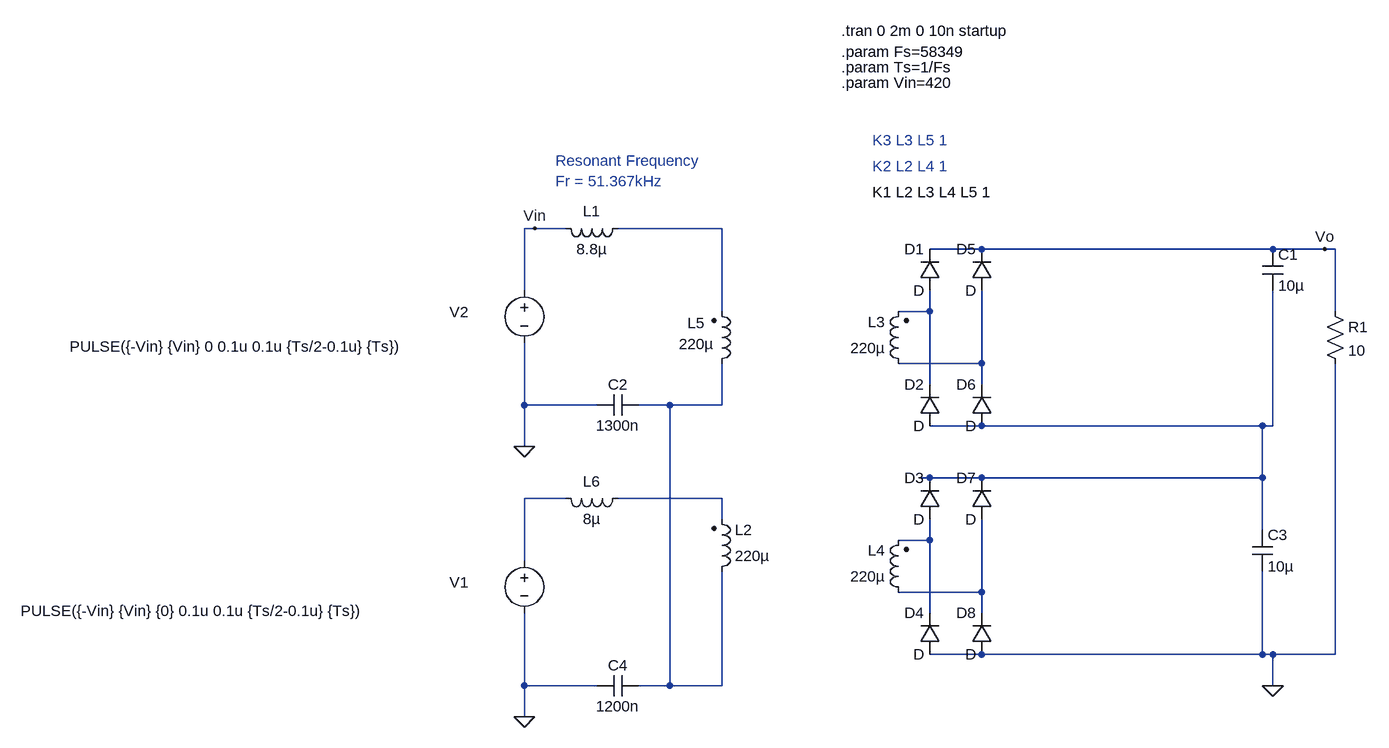
[diagram p0: schematic [Li2020] LLC 2-phase IPOS coupled transformer.asc]
[Li2020] LLC 2-phase IPOS coupled transformer.asc, the LTspice schematic file:
Version 4
SHEET 1 880 1140
WIRE -528 -96 -544 -96
WIRE -480 -96 -528 -96
WIRE -240 -96 -400 -96
WIRE 160 -64 80 -64
WIRE 608 -64 160 -64
WIRE 688 -64 608 -64
WIRE 704 -64 688 -64
WIRE -544 0 -544 -96
WIRE -240 32 -240 -96
WIRE 80 32 80 0
WIRE 80 32 32 32
WIRE 704 32 704 -64
WIRE 160 112 160 0
WIRE 160 112 32 112
WIRE 80 144 80 32
WIRE 160 144 160 112
WIRE -544 176 -544 80
WIRE -432 176 -544 176
WIRE -320 176 -368 176
WIRE -240 176 -240 112
WIRE -240 176 -320 176
WIRE 160 208 80 208
WIRE 592 208 160 208
WIRE 608 208 608 0
WIRE 608 208 592 208
WIRE -544 240 -544 176
WIRE 80 288 64 288
WIRE 160 288 80 288
WIRE 592 288 592 208
WIRE 592 288 160 288
WIRE -480 320 -544 320
WIRE -240 320 -400 320
WIRE -240 352 -240 320
WIRE 592 368 592 288
WIRE 80 384 80 352
WIRE 80 384 32 384
WIRE -544 416 -544 320
WIRE 160 464 160 352
WIRE 160 464 32 464
WIRE 80 496 80 384
WIRE 160 496 160 464
WIRE 160 560 80 560
WIRE 592 560 592 432
WIRE 592 560 160 560
WIRE 608 560 592 560
WIRE 704 560 704 112
WIRE 704 560 608 560
WIRE -544 608 -544 496
WIRE -432 608 -544 608
WIRE -320 608 -320 176
WIRE -320 608 -368 608
WIRE -240 608 -240 432
WIRE -240 608 -320 608
WIRE 608 608 608 560
WIRE -544 656 -544 608
FLAG 608 608 0
FLAG 688 -64 Vo
FLAG -544 240 0
FLAG -528 -96 Vin
FLAG -544 656 0
SYMBOL ind -496 -112 M90
WINDOW 0 5 56 VBottom 2
WINDOW 3 32 56 VTop 2
SYMATTR InstName L1
SYMATTR Value 8.8µ
SYMBOL ind2 -256 448 M180
WINDOW 0 36 80 Left 2
WINDOW 3 36 40 Left 2
SYMATTR InstName L2
SYMATTR Value 220µ
SYMATTR Type ind
SYMBOL ind2 48 128 R180
WINDOW 0 36 80 Left 2
WINDOW 3 36 40 Left 2
SYMATTR InstName L3
SYMATTR Value 220µ
SYMATTR Type ind
SYMBOL diode 96 0 R180
WINDOW 0 24 64 Left 2
WINDOW 3 24 0 Left 2
SYMATTR InstName D1
SYMBOL res 688 16 R0
SYMATTR InstName R1
SYMATTR Value 10
SYMBOL diode 96 208 R180
WINDOW 0 24 64 Left 2
WINDOW 3 24 0 Left 2
SYMATTR InstName D2
SYMBOL cap -432 192 R270
WINDOW 0 32 32 VTop 2
WINDOW 3 0 32 VBottom 2
SYMATTR InstName C2
SYMATTR Value 1300n
SYMBOL cap 576 368 R0
SYMATTR InstName C3
SYMATTR Value 10µ
SYMBOL diode 96 352 R180
WINDOW 0 24 64 Left 2
WINDOW 3 24 0 Left 2
SYMATTR InstName D3
SYMBOL diode 96 560 R180
WINDOW 0 24 64 Left 2
WINDOW 3 24 0 Left 2
SYMATTR InstName D4
SYMBOL ind2 48 480 R180
WINDOW 0 36 80 Left 2
WINDOW 3 36 40 Left 2
SYMATTR InstName L4
SYMATTR Value 220µ
SYMATTR Type ind
SYMBOL ind2 -256 128 M180
WINDOW 0 -37 78 Left 2
WINDOW 3 -50 46 Left 2
SYMATTR InstName L5
SYMATTR Value 220µ
SYMATTR Type ind
SYMBOL cap -432 624 R270
WINDOW 0 32 32 VTop 2
WINDOW 3 0 32 VBottom 2
SYMATTR InstName C4
SYMATTR Value 1200n
SYMBOL voltage -544 -16 R0
WINDOW 123 0 0 Left 0
WINDOW 39 0 0 Left 0
WINDOW 3 -700 102 Left 2
WINDOW 0 -115 49 Left 2
SYMATTR Value PULSE({-Vin} {Vin} 0 0.1u 0.1u {Ts/2-0.1u} {Ts})
SYMATTR InstName V2
SYMBOL voltage -544 400 R0
WINDOW 123 0 0 Left 0
WINDOW 39 0 0 Left 0
WINDOW 3 -775 93 Left 2
WINDOW 0 -115 49 Left 2
SYMATTR Value PULSE({-Vin} {Vin} {0} 0.1u 0.1u {Ts/2-0.1u} {Ts})
SYMATTR InstName V1
SYMBOL ind -496 304 M90
WINDOW 0 5 56 VBottom 2
WINDOW 3 32 56 VTop 2
SYMATTR InstName L6
SYMATTR Value 8µ
SYMBOL diode 176 0 R180
WINDOW 0 24 64 Left 2
WINDOW 3 24 0 Left 2
SYMATTR InstName D5
SYMBOL diode 176 208 R180
WINDOW 0 24 64 Left 2
WINDOW 3 24 0 Left 2
SYMATTR InstName D6
SYMBOL diode 176 352 R180
WINDOW 0 24 64 Left 2
WINDOW 3 24 0 Left 2
SYMATTR InstName D7
SYMBOL diode 176 560 R180
WINDOW 0 24 64 Left 2
WINDOW 3 24 0 Left 2
SYMATTR InstName D8
SYMBOL cap 592 -64 R0
SYMATTR InstName C1
SYMATTR Value 10µ
TEXT -8 -152 Left 2 !K1 L2 L3 L4 L5 1
TEXT -8 -192 Left 2 ;K2 L2 L4 1
TEXT -56 -400 Left 2 !.tran 0 2m 0 10n startup
TEXT -56 -368 Left 2 !.param Fs=58349
TEXT -56 -344 Left 2 !.param Ts=1/Fs
TEXT -56 -320 Left 2 !.param Vin=420
TEXT -496 -200 Left 2 ;Resonant Frequency\nFr = 51.367kHz
TEXT -8 -232 Left 2 ;K3 L3 L5 1

The netlist it stands for:
* [Li2020] LLC 2-phase IPOS coupled transformer.asc
L1 Vin N001 8.8µ
L2 N004 N007 220µ
L3 N003 N002 220µ
D1 N002 Vo D
R1 Vo 0 10
D2 N005 N002 D
C2 0 N004 1300n
C3 N005 0 10µ
D3 N008 N005 D
D4 0 N008 D
L4 N009 N008 220µ
L5 N004 N001 220µ
C4 0 N004 1200n
V2 Vin 0 PULSE({-Vin} {Vin} 0 0.1u 0.1u {Ts/2-0.1u} {Ts})
V1 N006 0 PULSE({-Vin} {Vin} {0} 0.1u 0.1u {Ts/2-0.1u} {Ts})
L6 N006 N007 8µ
D5 N003 Vo D
D6 N005 N003 D
D7 N009 N005 D
D8 0 N009 D
C1 Vo N005 10µ
.model D D
.lib standard.dio
K1 L2 L3 L4 L5 1
* K2 L2 L4 1
.tran 0 2m 0 10n startup
.param Fs=58349
.param Ts=1/Fs
.param Vin=420
* Resonant Frequency
* Fr = 51.367kHz
* K3 L3 L5 1
.backanno
.end